# EAGLE design ELED03 (EAGLE 7.4.0)
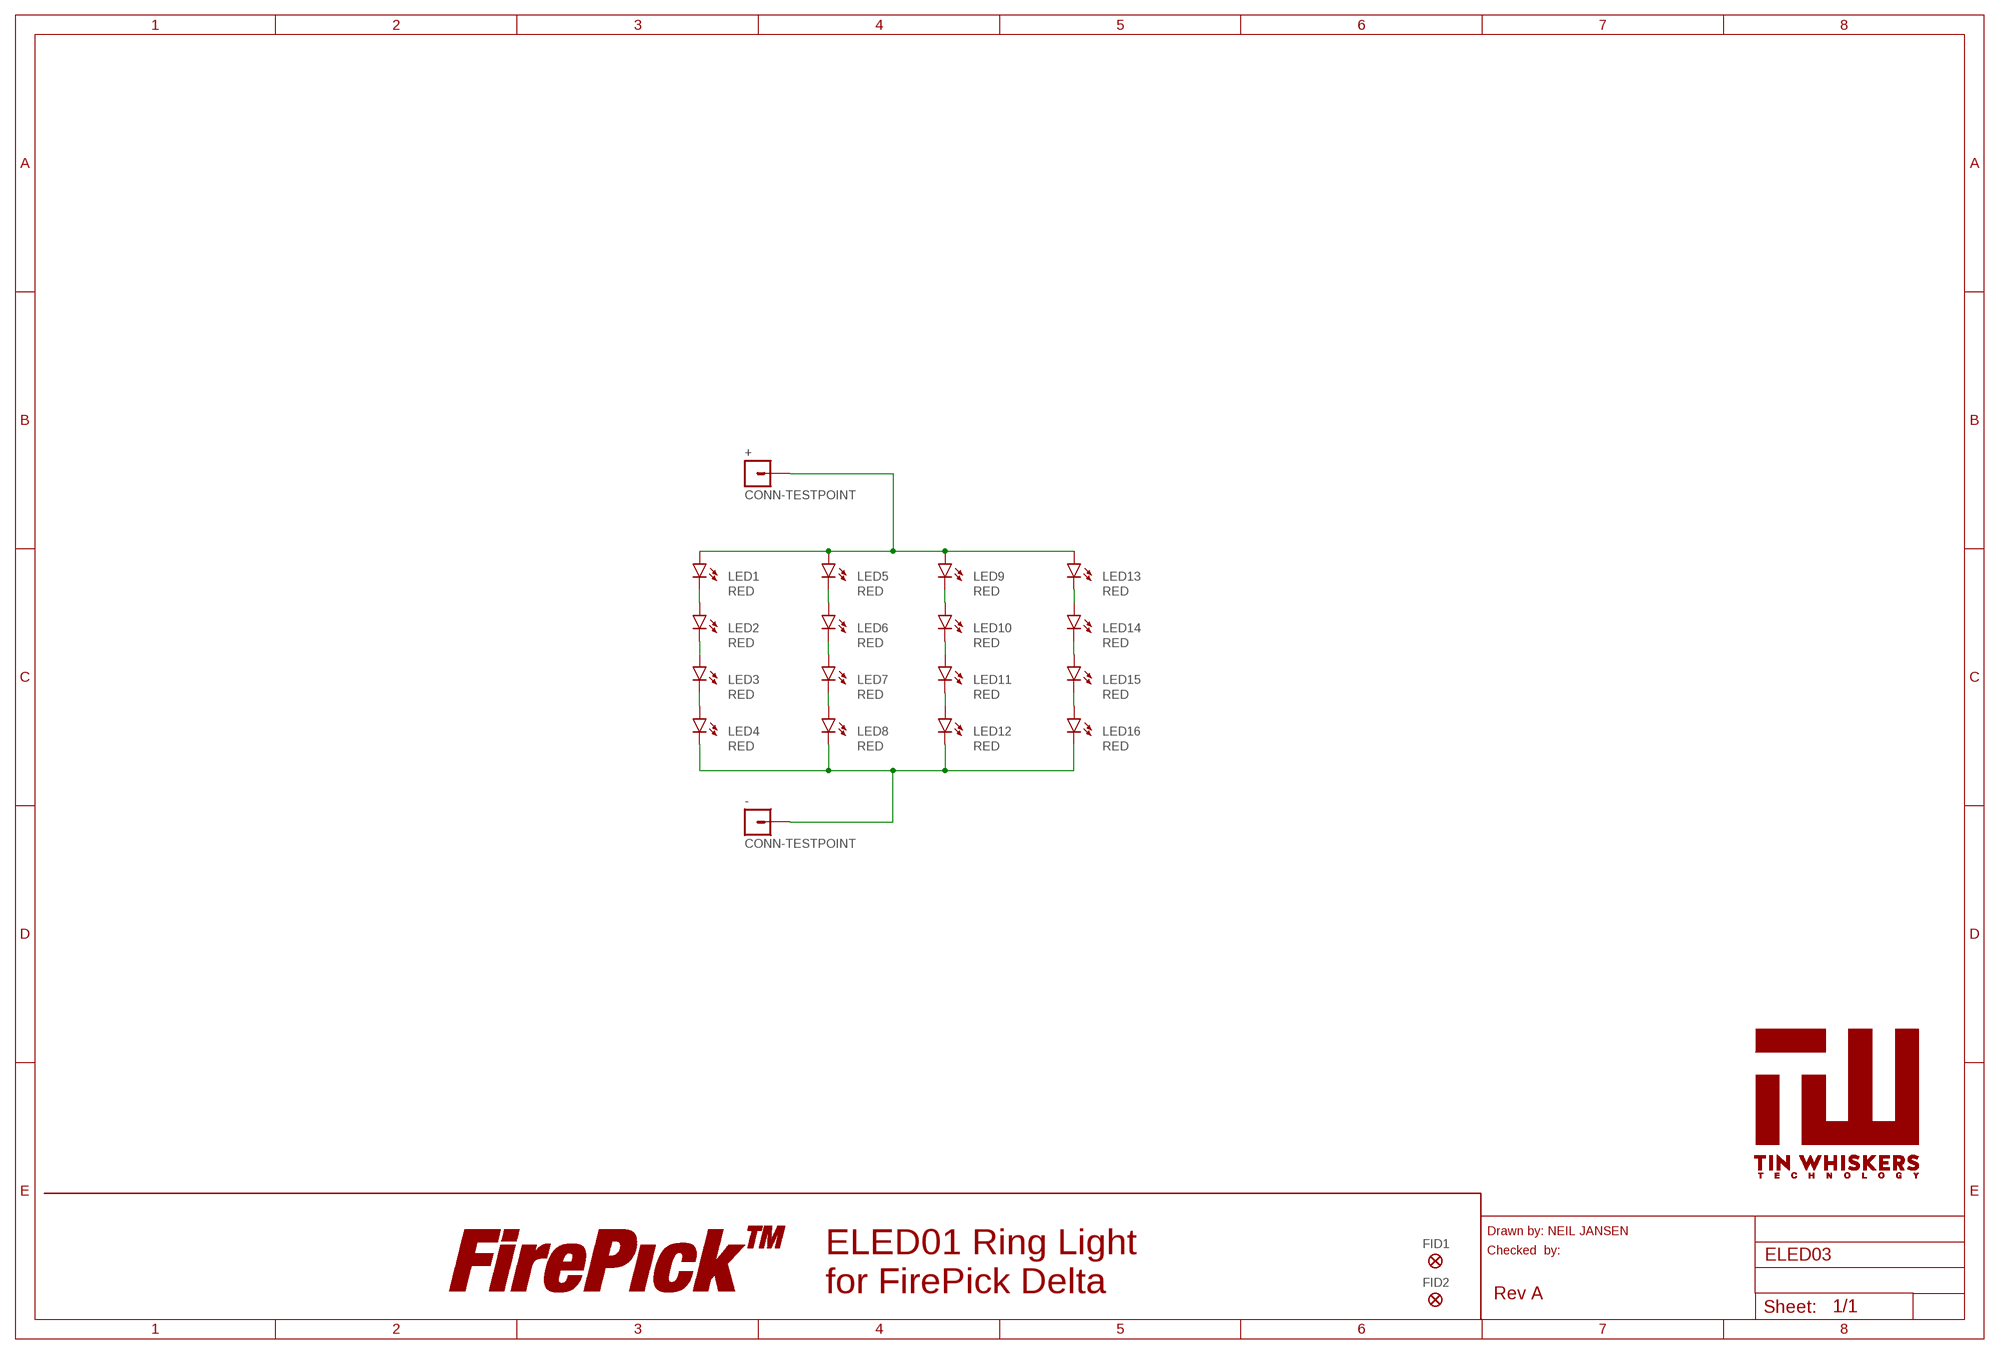
[diagram p0: schematic, sheet 1]

## Parts
+  CONN-TESTPOINT  [CON-TESTPOINT]
-  CONN-TESTPOINT  [CON-TESTPOINT]
FID1  FIDUCIAL  [FIDUCIAL]
FID2  FIDUCIAL  [FIDUCIAL]
LED1  RED  LED1210  [DIODE-1210]
LED2  RED  LED1210  [DIODE-1210]
LED3  RED  LED1210  [DIODE-1210]
LED4  RED  LED1210  [DIODE-1210]
LED5  RED  LED1210  [DIODE-1210]
LED6  RED  LED1210  [DIODE-1210]
LED7  RED  LED1210  [DIODE-1210]
LED8  RED  LED1210  [DIODE-1210]
LED9  RED  LED1210  [DIODE-1210]
LED10  RED  LED1210  [DIODE-1210]
LED11  RED  LED1210  [DIODE-1210]
LED12  RED  LED1210  [DIODE-1210]
LED13  RED  LED1210  [DIODE-1210]
LED14  RED  LED1210  [DIODE-1210]
LED15  RED  LED1210  [DIODE-1210]
LED16  RED  LED1210  [DIODE-1210]
LOGO4  LOGO-FIREPICKMEDIUM  [LOGO-FIREPICK-MEDIUM]
U$1  TIN-WHISKERSSMALL  [TIN-WHISKERS-SMALL]

## Nets
+: +.1 LED1.A LED5.A LED9.A LED13.A
-: -.1 LED4.K(C) LED8.K(C) LED12.K(C) LED16.K(C)
N$1: LED1.K(C) LED2.A
N$2: LED2.K(C) LED3.A
N$3: LED3.K(C) LED4.A
N$4: LED7.K(C) LED8.A
N$5: LED6.K(C) LED7.A
N$6: LED5.K(C) LED6.A
N$7: LED9.K(C) LED10.A
N$8: LED10.K(C) LED11.A
N$9: LED11.K(C) LED12.A
N$10: LED15.K(C) LED16.A
N$11: LED14.K(C) LED15.A
N$12: LED13.K(C) LED14.A

## Notes on the sheet
- Drawn by: NEIL JANSEN
- Checked  by:
- ELED01 Ring Light
  for FirePick Delta
- Rev A

## Library data of the parts
+ - = FirePick:CONN-TESTPOINT; PARTNO: *
FID1 FID2 = TinWhiskers:FIDUCIAL; PARTNO: *
LED1-LED16 = GinWhiskers - temp stuff:LED; PARTNO: QBLP650-IW
LOGO4 = FirePick:LOGO-FIREPICK; BOM: EXCLUDE; DNP: T
U$1 = !tin-whiskers-logo:TIN-WHISKERS; PARTNO: *

## Board
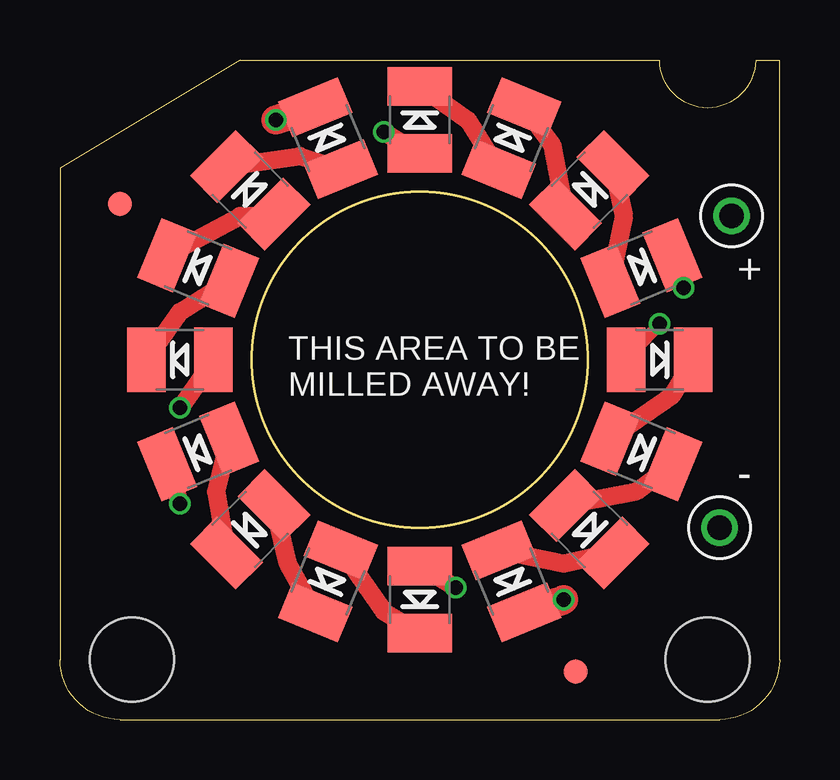
[diagram p1: board, top side]
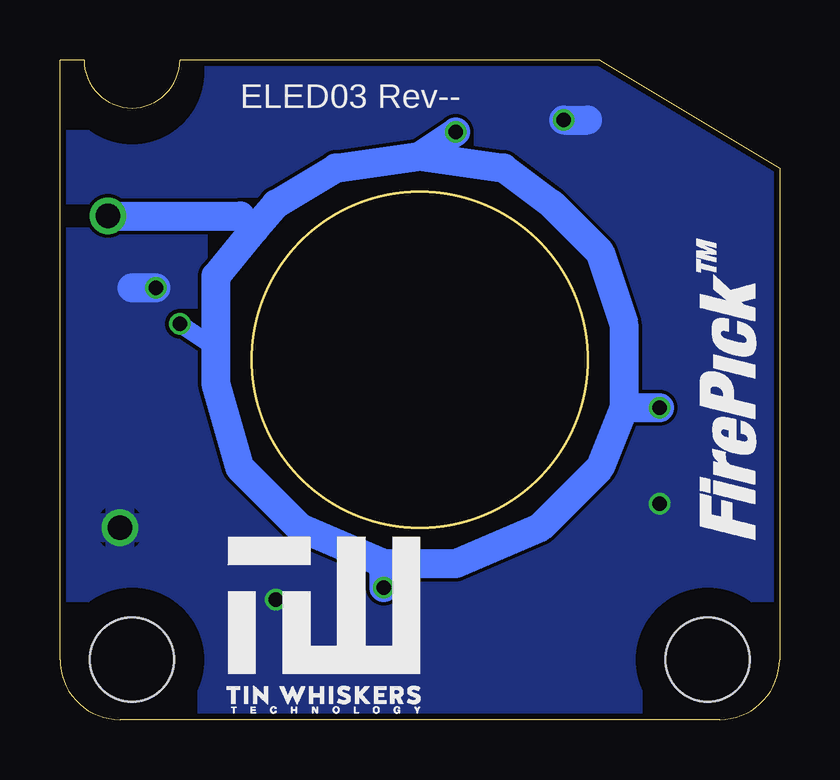
[diagram p2: board, bottom side, seen from below]

Size 30 x 27.5 mm. Coordinates in mm from the lower left corner, seen from the top.
Outline: 2.5,0 27.5,0 arc90 30,2.5 30,27.5 29,27.5 arc-180 25,27.5 7.5,27.5 0,23 0,2.5 arc90 2.5,0
Outline: circle at 15,15 radius 7
Copper layers (1*16): Top 0.035mm / dielectric 1.5mm / Bottom 0.035mm
Design rules "SeeedStudio_2layer_DRU_no_angle_20140221": minimum track width 6mil, minimum drill 12mil, track to track 6mil, track to pad 6mil, pad to pad 6mil, via to via 6mil, smd to smd 0mil, copper to edge 10mil, drill to drill 10mil, minimum pad ring 10mil, minimum via ring 6mil, stop-mask expansion 2mil, vias tented up to drill 100mil, thermal gap 10mil
Holes 3.5 mm at 3,2.5 27,2.5
tRestrict: area 0,-0.5 to 6,5.5; area 24,-0.5 to 30,5.5; area 24,24 to 30,30
bRestrict: area 0,-0.5 to 6,5.5; area 24,-0.5 to 30,5.5; area 24,24 to 30,30

### Footprints (pad centres in the part's own frame; a part is rotated, then mirrored left to right if it is on the bottom)
CON-TESTPOINT = drill 1.016: 1 0,0
FIDUCIAL = smd 1 x 1: 1 0,0
DIODE-1210 = smd 1.6 x 2.7: A -1.4,0; K 1.4,0

### Placement (x,y rotation side)
+  28,21 0 top
-  27.5,8 0 top
FID1  2.5,21.5 0 top
FID2  21.5,2 0 top
LED1  15,25 90 top
LED2  18.83,24.24 67.5 top
LED3  22.07,22.07 45 top
LED4  24.24,18.83 22.5 top
LED5  25,15 0 top
LED6  24.24,11.17 337.5 top
LED7  22.07,7.93 315 top
LED8  18.83,5.76 292.5 top
LED9  15,5 270 top
LED10  11.17,5.76 247.5 top
LED11  7.93,7.93 225 top
LED12  5.76,11.17 202.5 top
LED13  5,15 180 top
LED14  5.76,18.83 157.5 top
LED15  7.93,22.07 135 top
LED16  11.17,24.24 112.5 top
LOGO4  1,7.5 90 bottom
U$1  23.5,0 0 bottom

### Tracks (layer width: path | path; a pad name or v marks a point on that pad's centre or on a via)
+  (via drill 0.6)
  Top 0.5: LED5.A v25,16.5
  Top 0.75: LED9.A v16.5,5.5 | LED13.A v5,13 | LED1.A v13.5,24.5
  Bottom 0.75: v25,16.5 23.5,15.5
  Bottom 1.2: 21.9,20.42 23.5,18.5 23.5,15.5 23.5,14 22.5,10.5 20,8 16.5,6.5 | 21.9,20.42 21,21.5 18.5,23 15,23.5 | 15,23.5 11.5,23 9.5,21.5 7.5,19.5 6.5,16.5 6.5,13 | 6.5,13 7.5,10.5 10,8 13.5,6.5 16.5,6.5 | v16.5,5.5 16.5,6.5 | v5,13 6.5,13 | v13.5,24.5 15,23.5 | +.1 22.48,21 21.9,20.42
-  (via drill 0.6)
  Top 0.75: LED12.K v5,9 | LED4.K v26,18
  Top 1.2: LED16.K v9,25 | LED8.K v21,5
  Bottom 1.2: v9,25 8,25 | v26,18 27,18
  pour Bottom: 0,0 30,0 30,27 7,27 0,23
N$1
  Top 0.75: LED1.K 17,25 LED2.A
N$2
  Top 0.75: LED2.K 20.5,24 LED3.A
N$3
  Top 0.75: LED3.K 23.5,21 LED4.A
N$4
  Top 0.75: LED7.K 21,6.5 LED8.A
N$5
  Top 0.75: LED6.K 24,9.5 LED7.A
N$6
  Top 0.75: LED5.K 25.5,13.5 LED6.A
N$7
  Top 0.75: LED10.A 13.5,4.5 LED9.K
N$8
  Top 0.75: LED10.K 9.5,6.5 LED11.A
N$9
  Top 0.75: LED12.A 6.5,9.5 LED11.K
N$10
  Top 0.75: LED15.K 10,23.5 LED16.A
N$11
  Top 0.75: LED14.K 7.5,21 LED15.A
N$12
  Top 0.75: LED13.K 5,17 LED14.A

### Text on the board
tPlace: THIS AREA TO BE / MILLED AWAY!
bPlace: ELED03 Rev--